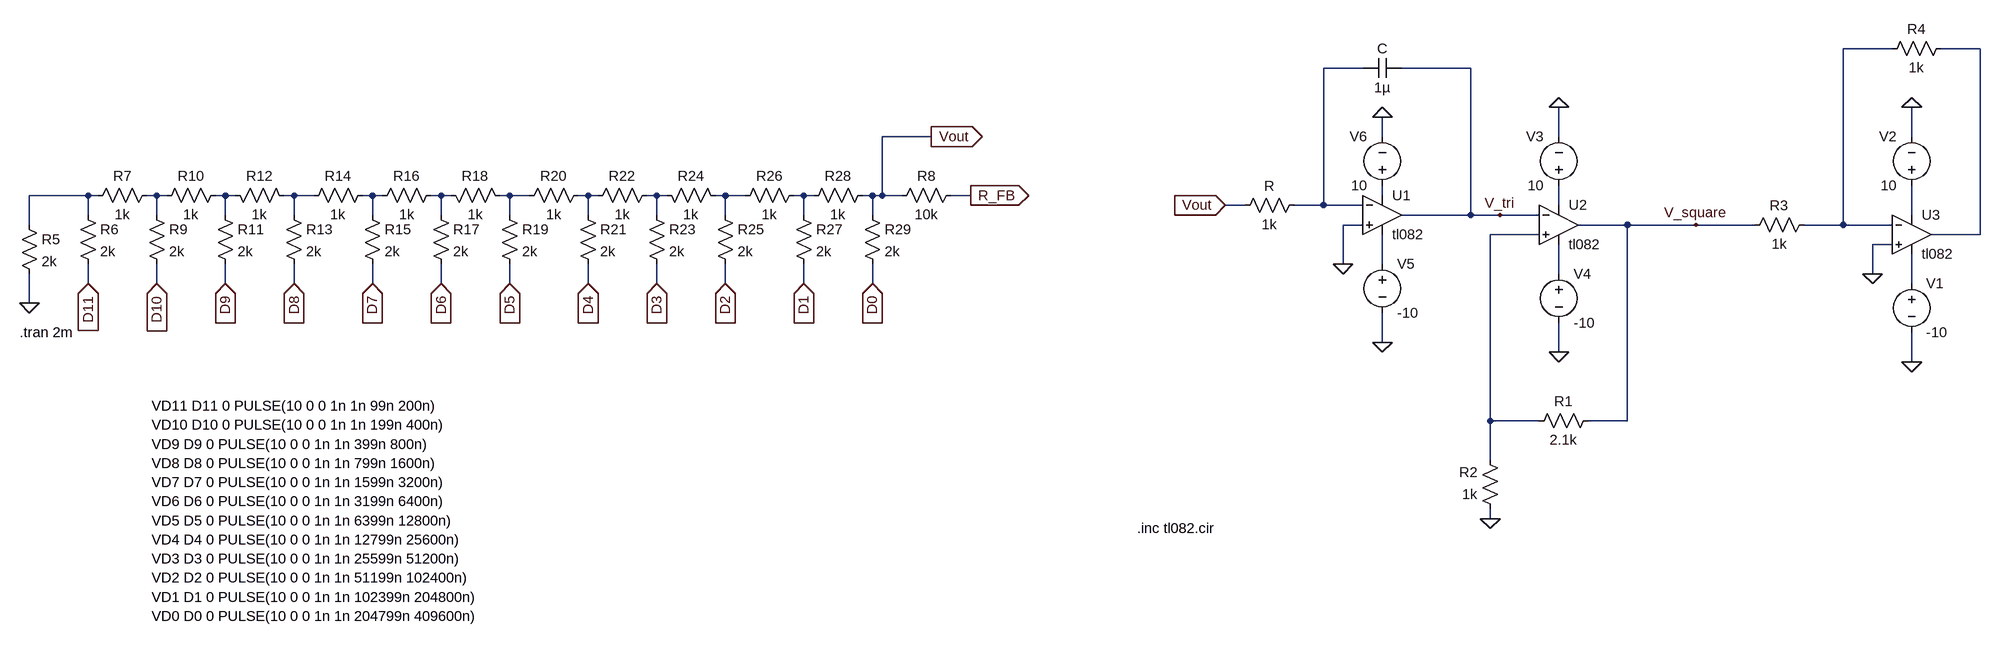
[diagram p0: schematic prog_square_and_tri_wave_generator_simulation.asc]
prog_square_and_tri_wave_generator_simulation.asc, the LTspice schematic file:
Version 4
SHEET 1 1332 680
WIRE 1184 -448 1104 -448
WIRE 1328 -448 1264 -448
WIRE 320 -416 256 -416
WIRE 496 -416 384 -416
WIRE -384 -304 -464 -304
WIRE 352 -304 352 -336
WIRE 640 -304 640 -352
WIRE 1216 -304 1216 -352
WIRE -1760 -208 -1856 -208
WIRE -1744 -208 -1760 -208
WIRE -1648 -208 -1664 -208
WIRE -1632 -208 -1648 -208
WIRE -1536 -208 -1552 -208
WIRE -1520 -208 -1536 -208
WIRE -1424 -208 -1440 -208
WIRE -1392 -208 -1424 -208
WIRE -1296 -208 -1312 -208
WIRE -1280 -208 -1296 -208
WIRE -1184 -208 -1200 -208
WIRE -1168 -208 -1184 -208
WIRE -1072 -208 -1088 -208
WIRE -1040 -208 -1072 -208
WIRE -944 -208 -960 -208
WIRE -928 -208 -944 -208
WIRE -832 -208 -848 -208
WIRE -816 -208 -832 -208
WIRE -720 -208 -736 -208
WIRE -688 -208 -720 -208
WIRE -592 -208 -608 -208
WIRE -576 -208 -592 -208
WIRE -480 -208 -496 -208
WIRE -464 -208 -464 -304
WIRE -464 -208 -480 -208
WIRE -432 -208 -464 -208
WIRE -320 -208 -352 -208
WIRE 352 -208 352 -224
WIRE 128 -192 96 -192
WIRE 256 -192 256 -416
WIRE 256 -192 208 -192
WIRE 320 -192 256 -192
WIRE 640 -192 640 -224
WIRE -1760 -176 -1760 -208
WIRE -1648 -176 -1648 -208
WIRE -1536 -176 -1536 -208
WIRE -1424 -176 -1424 -208
WIRE -1296 -176 -1296 -208
WIRE -1184 -176 -1184 -208
WIRE -1072 -176 -1072 -208
WIRE -944 -176 -944 -208
WIRE -832 -176 -832 -208
WIRE -720 -176 -720 -208
WIRE -592 -176 -592 -208
WIRE -480 -176 -480 -208
WIRE 496 -176 496 -416
WIRE 496 -176 384 -176
WIRE 544 -176 496 -176
WIRE 608 -176 544 -176
WIRE 1216 -176 1216 -224
WIRE -1856 -160 -1856 -208
WIRE 320 -160 288 -160
WIRE 752 -160 672 -160
WIRE 864 -160 752 -160
WIRE 960 -160 864 -160
WIRE 1104 -160 1104 -448
WIRE 1104 -160 1040 -160
WIRE 1184 -160 1104 -160
WIRE 608 -144 528 -144
WIRE 1328 -144 1328 -448
WIRE 1328 -144 1248 -144
WIRE 1184 -128 1152 -128
WIRE 288 -96 288 -160
WIRE 352 -96 352 -144
WIRE 640 -80 640 -128
WIRE 1152 -80 1152 -128
WIRE -1760 -64 -1760 -96
WIRE -1648 -64 -1648 -96
WIRE -1536 -64 -1536 -96
WIRE -1424 -64 -1424 -96
WIRE -1296 -64 -1296 -96
WIRE -1184 -64 -1184 -96
WIRE -1072 -64 -1072 -96
WIRE -944 -64 -944 -96
WIRE -832 -64 -832 -96
WIRE -720 -64 -720 -96
WIRE -592 -64 -592 -96
WIRE -480 -64 -480 -96
WIRE 1216 -64 1216 -112
WIRE -1856 -32 -1856 -80
WIRE 352 32 352 -16
WIRE 640 48 640 0
WIRE 1216 64 1216 16
WIRE 528 160 528 -144
WIRE 608 160 528 160
WIRE 752 160 752 -160
WIRE 752 160 688 160
WIRE 528 224 528 160
WIRE 528 320 528 304
FLAG 1216 64 0
FLAG 1216 -352 0
FLAG 1152 -80 0
FLAG 640 -352 0
FLAG 640 48 0
FLAG 528 320 0
FLAG 352 32 0
FLAG 352 -336 0
FLAG 288 -96 0
FLAG 864 -160 V_square
FLAG 544 -176 V_tri
FLAG -1856 -32 0
FLAG -384 -304 Vout
IOPIN -384 -304 Out
FLAG -1760 -64 D11
IOPIN -1760 -64 In
FLAG -1648 -64 D10
IOPIN -1648 -64 In
FLAG -1536 -64 D9
IOPIN -1536 -64 In
FLAG -1424 -64 D8
IOPIN -1424 -64 In
FLAG -1296 -64 D7
IOPIN -1296 -64 In
FLAG -1184 -64 D6
IOPIN -1184 -64 In
FLAG -1072 -64 D5
IOPIN -1072 -64 In
FLAG -944 -64 D4
IOPIN -944 -64 In
FLAG -832 -64 D3
IOPIN -832 -64 In
FLAG -720 -64 D2
IOPIN -720 -64 In
FLAG -592 -64 D1
IOPIN -592 -64 In
FLAG -480 -64 D0
IOPIN -480 -64 In
FLAG -320 -208 R_FB
IOPIN -320 -208 Out
FLAG 96 -192 Vout
IOPIN 96 -192 In
SYMBOL Opamps\\opamp2 352 -240 R0
SYMATTR InstName U1
SYMATTR Value tl082
SYMBOL Opamps\\opamp2 640 -224 R0
SYMATTR InstName U2
SYMATTR Value tl082
SYMBOL Opamps\\opamp2 1216 -208 R0
SYMATTR InstName U3
SYMATTR Value tl082
SYMBOL voltage 1216 -80 R0
WINDOW 123 0 0 Left 0
WINDOW 39 0 0 Left 0
SYMATTR InstName V1
SYMATTR Value -10
SYMBOL voltage 1216 -208 R180
WINDOW 0 24 96 Left 2
WINDOW 3 24 16 Left 2
WINDOW 123 0 0 Left 0
WINDOW 39 0 0 Left 0
SYMATTR InstName V2
SYMATTR Value 10
SYMBOL res 1280 -464 R90
WINDOW 0 0 56 VBottom 2
WINDOW 3 32 56 VTop 2
SYMATTR InstName R4
SYMATTR Value 1k
SYMBOL res 1056 -176 R90
WINDOW 0 0 56 VBottom 2
WINDOW 3 32 56 VTop 2
SYMATTR InstName R3
SYMATTR Value 1k
SYMBOL voltage 640 -208 R180
WINDOW 0 24 96 Left 2
WINDOW 3 24 16 Left 2
WINDOW 123 0 0 Left 0
WINDOW 39 0 0 Left 0
SYMATTR InstName V3
SYMATTR Value 10
SYMBOL voltage 640 -96 R0
WINDOW 123 0 0 Left 0
WINDOW 39 0 0 Left 0
SYMATTR InstName V4
SYMATTR Value -10
SYMBOL res 704 144 R90
WINDOW 0 0 56 VBottom 2
WINDOW 3 32 56 VTop 2
SYMATTR InstName R1
SYMATTR Value 2.1k
SYMBOL res 544 320 R180
WINDOW 0 36 76 Left 2
WINDOW 3 36 40 Left 2
SYMATTR InstName R2
SYMATTR Value 1k
SYMBOL voltage 352 -112 R0
WINDOW 123 0 0 Left 0
WINDOW 39 0 0 Left 0
SYMATTR InstName V5
SYMATTR Value -10
SYMBOL voltage 352 -208 R180
WINDOW 0 24 96 Left 2
WINDOW 3 24 16 Left 2
WINDOW 123 0 0 Left 0
WINDOW 39 0 0 Left 0
SYMATTR InstName V6
SYMATTR Value 10
SYMBOL cap 384 -432 R90
WINDOW 0 0 32 VBottom 2
WINDOW 3 32 32 VTop 2
SYMATTR InstName C
SYMATTR Value 1µ
SYMBOL res 224 -208 R90
WINDOW 0 0 56 VBottom 2
WINDOW 3 32 56 VTop 2
SYMATTR InstName R
SYMATTR Value 1k
SYMBOL res -1872 -176 R0
SYMATTR InstName R5
SYMATTR Value 2k
SYMBOL res -1776 -192 R0
SYMATTR InstName R6
SYMATTR Value 2k
SYMBOL res -1760 -192 R270
WINDOW 0 32 56 VTop 2
WINDOW 3 0 56 VBottom 2
SYMATTR InstName R7
SYMATTR Value 1k
SYMBOL res -336 -224 R90
WINDOW 0 0 56 VBottom 2
WINDOW 3 32 56 VTop 2
SYMATTR InstName R8
SYMATTR Value 10k
SYMBOL res -1664 -192 R0
SYMATTR InstName R9
SYMATTR Value 2k
SYMBOL res -1648 -192 R270
WINDOW 0 32 56 VTop 2
WINDOW 3 0 56 VBottom 2
SYMATTR InstName R10
SYMATTR Value 1k
SYMBOL res -1552 -192 R0
SYMATTR InstName R11
SYMATTR Value 2k
SYMBOL res -1424 -192 M270
WINDOW 0 32 56 VTop 2
WINDOW 3 0 56 VBottom 2
SYMATTR InstName R12
SYMATTR Value 1k
SYMBOL res -1440 -192 R0
SYMATTR InstName R13
SYMATTR Value 2k
SYMBOL res -1408 -192 R270
WINDOW 0 32 56 VTop 2
WINDOW 3 0 56 VBottom 2
SYMATTR InstName R14
SYMATTR Value 1k
SYMBOL res -1312 -192 R0
SYMATTR InstName R15
SYMATTR Value 2k
SYMBOL res -1296 -192 R270
WINDOW 0 32 56 VTop 2
WINDOW 3 0 56 VBottom 2
SYMATTR InstName R16
SYMATTR Value 1k
SYMBOL res -1200 -192 R0
SYMATTR InstName R17
SYMATTR Value 2k
SYMBOL res -1072 -192 M270
WINDOW 0 32 56 VTop 2
WINDOW 3 0 56 VBottom 2
SYMATTR InstName R18
SYMATTR Value 1k
SYMBOL res -1088 -192 R0
SYMATTR InstName R19
SYMATTR Value 2k
SYMBOL res -1056 -192 R270
WINDOW 0 32 56 VTop 2
WINDOW 3 0 56 VBottom 2
SYMATTR InstName R20
SYMATTR Value 1k
SYMBOL res -960 -192 R0
SYMATTR InstName R21
SYMATTR Value 2k
SYMBOL res -944 -192 R270
WINDOW 0 32 56 VTop 2
WINDOW 3 0 56 VBottom 2
SYMATTR InstName R22
SYMATTR Value 1k
SYMBOL res -848 -192 R0
SYMATTR InstName R23
SYMATTR Value 2k
SYMBOL res -720 -192 M270
WINDOW 0 32 56 VTop 2
WINDOW 3 0 56 VBottom 2
SYMATTR InstName R24
SYMATTR Value 1k
SYMBOL res -736 -192 R0
SYMATTR InstName R25
SYMATTR Value 2k
SYMBOL res -704 -192 R270
WINDOW 0 32 56 VTop 2
WINDOW 3 0 56 VBottom 2
SYMATTR InstName R26
SYMATTR Value 1k
SYMBOL res -608 -192 R0
SYMATTR InstName R27
SYMATTR Value 2k
SYMBOL res -592 -192 R270
WINDOW 0 32 56 VTop 2
WINDOW 3 0 56 VBottom 2
SYMATTR InstName R28
SYMATTR Value 1k
SYMBOL res -496 -192 R0
SYMATTR InstName R29
SYMATTR Value 2k
TEXT -48 336 Left 2 !.inc tl082.cir
TEXT -1872 16 Left 2 !.tran 2m
TEXT -1656 136 Left 2 !VD11 D11 0 PULSE(10 0 0 1n 1n 99n 200n)\nVD10 D10 0 PULSE(10 0 0 1n 1n 199n 400n)\nVD9 D9 0 PULSE(10 0 0 1n 1n 399n 800n)\nVD8 D8 0 PULSE(10 0 0 1n 1n 799n 1600n)\nVD7 D7 0 PULSE(10 0 0 1n 1n 1599n 3200n)\nVD6 D6 0 PULSE(10 0 0 1n 1n 3199n 6400n)\nVD5 D5 0 PULSE(10 0 0 1n 1n 6399n 12800n)\nVD4 D4 0 PULSE(10 0 0 1n 1n 12799n 25600n)\nVD3 D3 0 PULSE(10 0 0 1n 1n 25599n 51200n)\nVD2 D2 0 PULSE(10 0 0 1n 1n 51199n 102400n)\nVD1 D1 0 PULSE(10 0 0 1n 1n 102399n 204800n)\nVD0 D0 0 PULSE(10 0 0 1n 1n 204799n 409600n)

The netlist it stands for:
* prog_square_and_tri_wave_generator_simulation.asc
XU1 0 N003 N015 N019 V_tri tl082  ; pins In+ In- V+ V- OUT
XU2 N018 V_tri N016 N020 V_square tl082  ; pins In+ In- V+ V- OUT
XU3 0 N001 N017 N021 N002 tl082  ; pins In+ In- V+ V- OUT
V1 N021 0 -10
V2 N017 0 10
R4 N002 N001 1k
R3 N001 V_square 1k
V3 N016 0 10
V4 N020 0 -10
R1 V_square N018 2.1k
R2 0 N018 1k
V5 N019 0 -10
V6 N015 0 10
C V_tri N003 1µ
R N003 Vout 1k
R5 N004 0 2k
R6 N004 D11 2k
R7 N004 N005 1k
R8 R_FB Vout 10k
R9 N005 D10 2k
R10 N005 N006 1k
R11 N006 D9 2k
R12 N007 N006 1k
R13 N007 D8 2k
R14 N007 N008 1k
R15 N008 D7 2k
R16 N008 N009 1k
R17 N009 D6 2k
R18 N010 N009 1k
R19 N010 D5 2k
R20 N010 N011 1k
R21 N011 D4 2k
R22 N011 N012 1k
R23 N012 D3 2k
R24 N013 N012 1k
R25 N013 D2 2k
R26 N013 N014 1k
R27 N014 D1 2k
R28 N014 Vout 1k
R29 Vout D0 2k
.inc tl082.cir
.tran 2m
VD11 D11 0 PULSE(10 0 0 1n 1n 99n 200n)
VD10 D10 0 PULSE(10 0 0 1n 1n 199n 400n)
VD9 D9 0 PULSE(10 0 0 1n 1n 399n 800n)
VD8 D8 0 PULSE(10 0 0 1n 1n 799n 1600n)
VD7 D7 0 PULSE(10 0 0 1n 1n 1599n 3200n)
VD6 D6 0 PULSE(10 0 0 1n 1n 3199n 6400n)
VD5 D5 0 PULSE(10 0 0 1n 1n 6399n 12800n)
VD4 D4 0 PULSE(10 0 0 1n 1n 12799n 25600n)
VD3 D3 0 PULSE(10 0 0 1n 1n 25599n 51200n)
VD2 D2 0 PULSE(10 0 0 1n 1n 51199n 102400n)
VD1 D1 0 PULSE(10 0 0 1n 1n 102399n 204800n)
VD0 D0 0 PULSE(10 0 0 1n 1n 204799n 409600n)
.backanno
.end